# Altium schematic sheet 4_BLE-T3_power.SchDoc: PCA10056 - nRF52840 MCU
size A3; Organization: Nordic Semiconductor; DocumentNumber: 2; SheetNumber: 2; SheetTotal: 7; CompanyName: Nordic Semiconductor
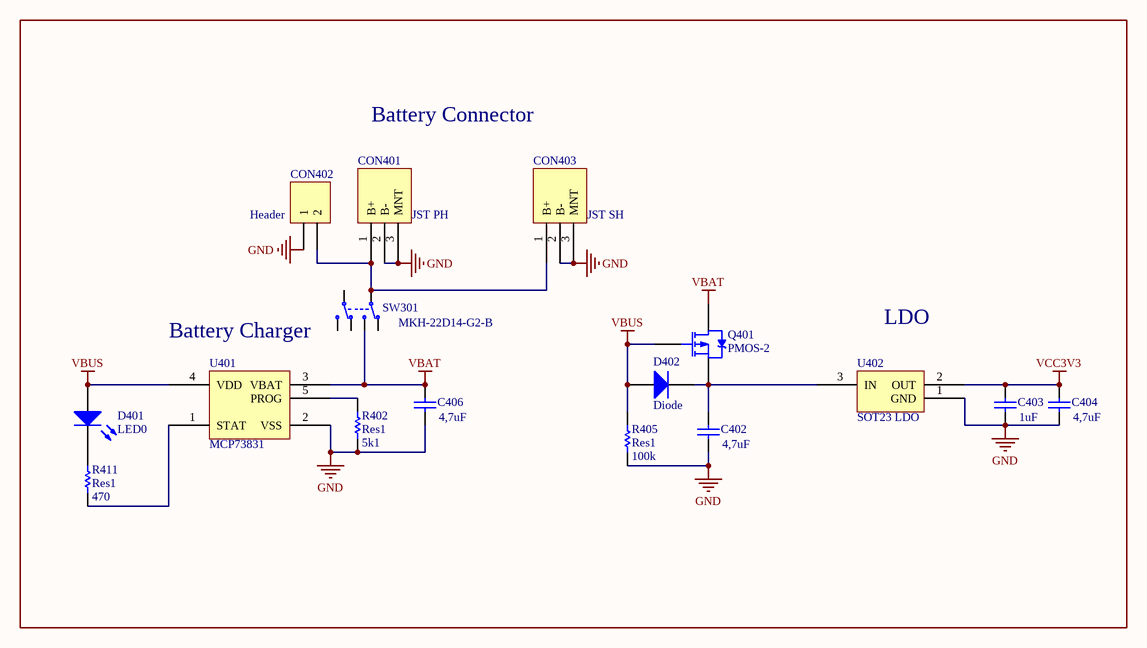
[diagram p0: 4_BLE-T3_power.SchDoc]

## Parts
C402  value 4,7uF  [C0603[1608]]
C403  value 1uF  [C0603[1608]]
C404  value 4,7uF  [C0603[1608]]
C406  value 4,7uF  [C0603[1608]]
CON401  JST PH  [JST S2B-PH-SM4-TB]
CON402  Header  [HDR1X2]  (no BOM)
CON403  JST SH  [JST SM02B-SRSS-TB]
D401  LED0  [LED0603[1608]]
D402  Diode  [SOD-123]
Q401  PMOS-2  [SOT-23-3]
R402  Res1  value 5k1  [R0603[1608]]
R405  Res1  value 100k  [R0603[1608]]
R411  Res1  value 470  [R0603[1608]]
SW301  MKH-22D14-G2-B  [MKH-22D14-G2-B]
U401  MCP73831  [SOT-23-5]
U402  SOT23 LDO  [SOT-23-3]

## Nets
GND: C402.1 C403.1 C404.1 C406.1 CON401.2(B-) CON401.3(MNT) CON402.1 CON403.2(B-) CON403.3(MNT) R402.2 R405.2 U401.2(VSS) U402.1(GND)
VBAT: C406.2 Q401.3(D) SW301.1(N.O-1) U401.3(VBAT)
VBUS: D401.1(A) D402.1(A) Q401.1(G) R405.1 U401.4(VDD)
VCC3V3: C403.2 C404.2 U402.2(OUT)
NetC402_2: C402.2 D402.2(K) Q401.2(S) U402.3(IN)
NetCON401_1: CON401.1(B+) CON402.2 CON403.1(B+) SW301.2(COM-1)
NetD401_2: D401.2(K) R411.2
NetR402_1: R402.1 U401.5(PROG)
NetR411_1: R411.1 U401.1(STAT)

Not connected (* = marked no-connect by the designer): SW301 3(N.C-1) 4(N.O-2) 5(COM-2) 6(N.C-2)

## Notes on the sheet
- Battery Connector
- (near SW301) Battery Charger
- LDO
- Title
- Size:
- Date:
- A3
- Number:
- Time:
- Revision:
- Sheet
- of
- File:

## Library data of the parts
C402 C404 C406 = Cap: Capacitor; MRF.Part: CL10A475KO8NNNC; LCSC MFG: Samsung Electro-Mechanics; LCSC Part #: C19666
C403 = Cap: Capacitor; MRF.Part: CL10A105KB8NNNC; MFG: KEMET; MFGPN: C0603C104M5RACTU; LCSC MFG: Samsung Electro-Mechanics; Version: 0603 imperial; LCSC Part #: C15849
CON401 CON403 = JST S2B-PH-SM4-TB: MFGPN: S2B-PH-SM4-TB(LF)(SN); MFG: JST Sales America Inc.
CON402 = Header 2: Header, 2-Pin
D401 = LED0: Typical INFRARED GaAs LED; MRF.Part: 19-213/Y2C-CQ2R2L/3T(CY); LCSC MFG: Everlight Elec; LCSC Part #: C72038
D402 = Diode: Default Diode; MRF.Part: B5819W; LCSC MFG: Changjiang Electronics Tech (CJ); Version: SOD-123; LCSC Part #: C8598
Q401 = PMOS-2: P-Channel Power MOSFET; MRF.Part: SI2301CDS-T1-GE3; Note: Pin 4 not drawn and electrically connected to Pin 2.; LCSC MFG: Vishay Intertech; LCSC Part #: C10487
R402 = Res1: Resistor; MRF.Part: 0603WAF5101T5E; MFG: Panasonic Electronic Components; MFGPN: ERJ-3EKF5101V; LCSC MFG: Uniroyal Elec; Version: 0603 imperial; LCSC Part #: C23186
R405 = Res1: Resistor; MRF.Part: 0603WAF1003T5E; LCSC MFG: Uniroyal Elec; Version: 0603 imperial; LCSC Part #: C25803
R411 = Res1: Resistor; MRF.Part: 0603WAF4700T5E; MFG: Panasonic Electronic Components; MFGPN: ERJ-3EKF5101V; LCSC MFG: UNI-ROYAL(Uniroyal Elec); Version: 0603 imperial; LCSC Part #: C23179
SW301 = MKH-22D14-G2-B: Slide Switch DPDT; MFG: Nidec Copal Electronics; MFGPN: CL-SB-22B-11T; Value: MKH-22D14-G2-B
U401 = MCP73831: MRF.Part: TP4054; LCSC MFG: Nanjing Extension Microelectronics; LCSC Part #: C32574
U402 = SOT23 LDO: MRF.Part: XC6206P332MR; LCSC MFG: Torex Semicon; MFG: Texas Instruments; MFGPN: TPS7A0533PDBZ; LCSC Part #: C5446